# Altium schematic sheet Sheet1.SchDoc
size A4; SheetNumber: 1; SheetTotal: 1
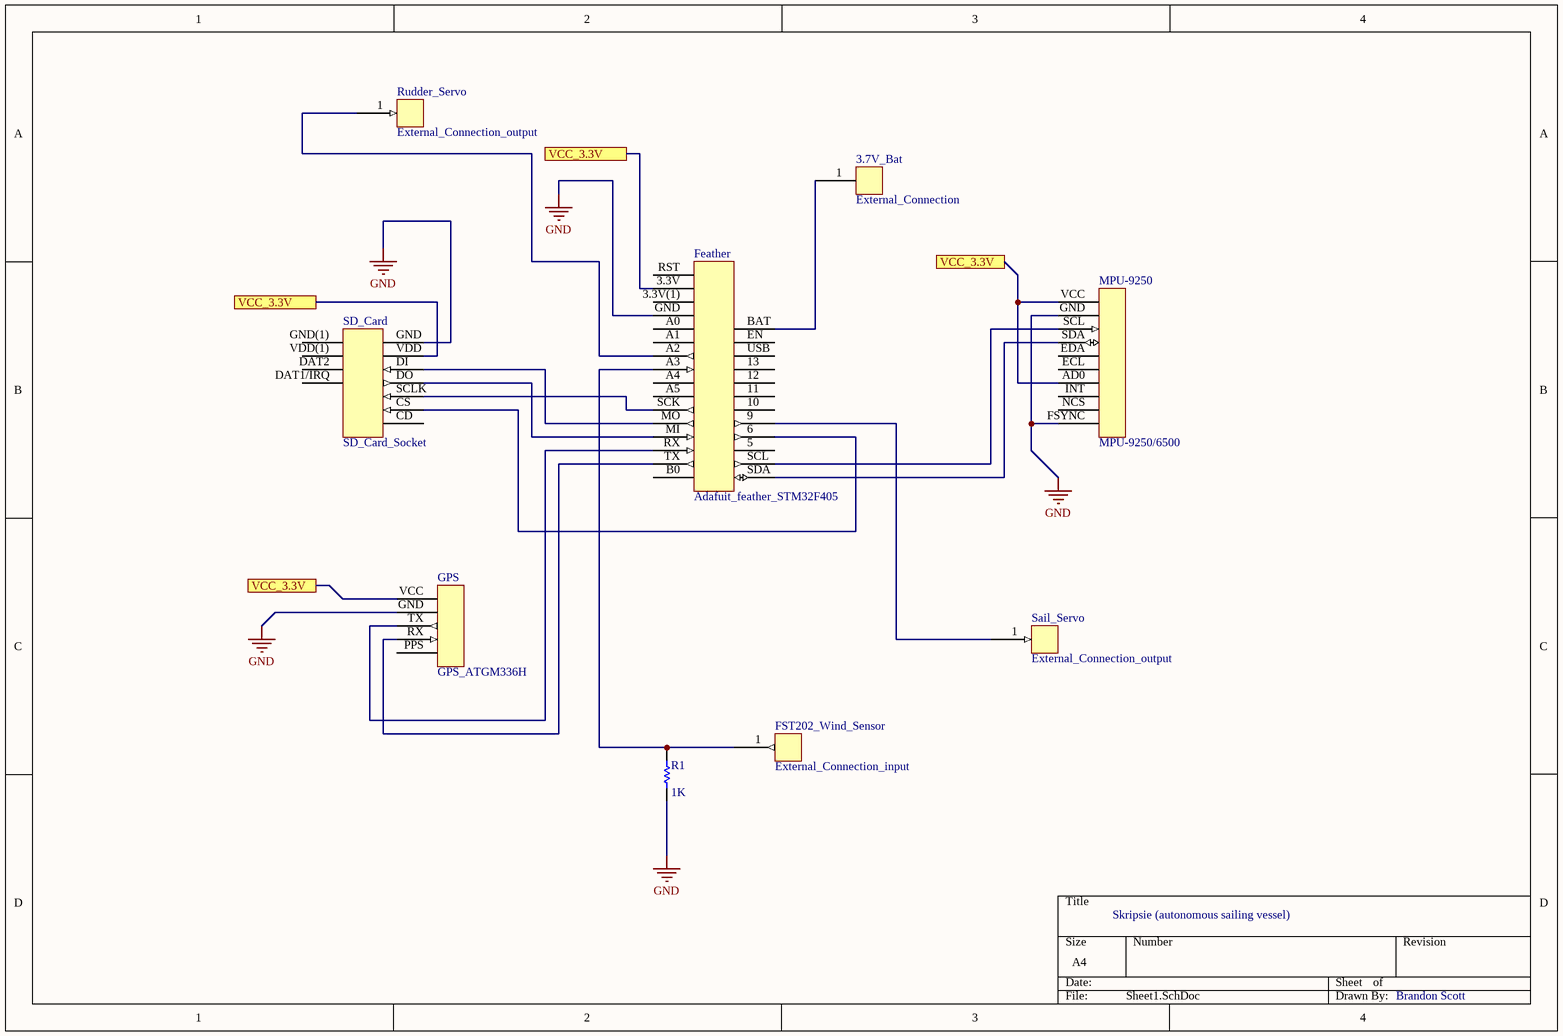
[diagram p0: Sheet1.SchDoc]

## Parts
3.7V_Bat  External_Connection  [connector]
Feather  Adafuit_feather_STM32F405  [Adafuit_feather_STM32F405]
FST202_Wind_Sensor  External_Connection_input  [connector]
GPS  GPS_ATGM336H  [GPS]
MPU-9250  MPU-9250/6500  [MPU-9250/6500]
R1  value 1K  [AXIAL-0.3]  (hidden comment: Res1)
Rudder_Servo  External_Connection_output  [connector]
Sail_Servo  External_Connection_output  [connector]
SD_Card  SD_Card_Socket  [SD_Card_Socket]

## Ports
VCC_3.3V

## Nets
GND: Feather.GND GPS.GND MPU-9250.FSYNC MPU-9250.GND R1.2 SD_Card.GND
VCC_3.3V: Feather.3.3V GPS.VCC MPU-9250.AD0 MPU-9250.VCC SD_Card.VDD ; port VCC_3.3V
Net3.7V_Bat_1: 3.7V_Bat.1 Feather.BAT
NetFeather_6: Feather.6 SD_Card.CS
NetFeather_9: Feather.9 Sail_Servo.1
NetFeather_A2: Feather.A2 Rudder_Servo.1
NetFeather_A3: Feather.A3 FST202_Wind_Sensor.1 R1.1
NetFeather_MI: Feather.MI SD_Card.DO
NetFeather_MO: Feather.MO SD_Card.DI
NetFeather_RX: Feather.RX GPS.TX
NetFeather_SCK: Feather.SCK SD_Card.SCLK
NetFeather_SCL: Feather.SCL MPU-9250.SCL
NetFeather_SDA: Feather.SDA MPU-9250.SDA
NetFeather_TX: Feather.TX GPS.RX

Not connected (* = marked no-connect by the designer): Feather 3.3V(1) 5 10 11 12 13 A0 A1 A4 A5 B0 EN RST USB; GPS PPS; MPU-9250 ECL EDA INT NCS; SD_Card CD DAT1/IRQ DAT2 GND(1) VDD(1)

## Notes on the sheet
- Skripsie (autonomous sailing vessel)
- Brandon Scott

## Library data of the parts
R1 = Res1: Resistor; Published: 8-Jun-2000; LatestRevisionDate: 17-Jul-2002; LatestRevisionNote: Re-released for DXP Platform.; PackageReference: AXIAL-0.3; Publisher: Altium Limited; PackageDescription: Axial Device, Thru-Hole; 2 Leads; 0.3 in Pin Spacing